# EAGLE schematic ex1 (EAGLE 7.5.0)
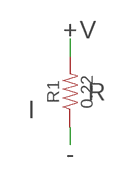
[diagram p0: schematic, sheet 1]

## Parts
R1  0.22  0.22OHM-0805-1/4W-1%  [0805]

## Nets
N$1: R1.1
N$2: R1.2

## Notes on the sheet
- + | V
- R
- I
- -

## Library data of the parts
R1 = SparkFun-Resistors:0.22OHM: 0.22Ω resistor A resistor is a passive two-terminal electrical component that implements electrical resistance as a circuit element. Resistors act to reduce current flow, and, at the same time, act to lower voltage levels within circuits. - Wikipedia; PROD_ID: RES-09883